# EAGLE schematic Sudden_XCVR_IF_Module_Schematic_like_board_layout (EAGLE 9.2.2)
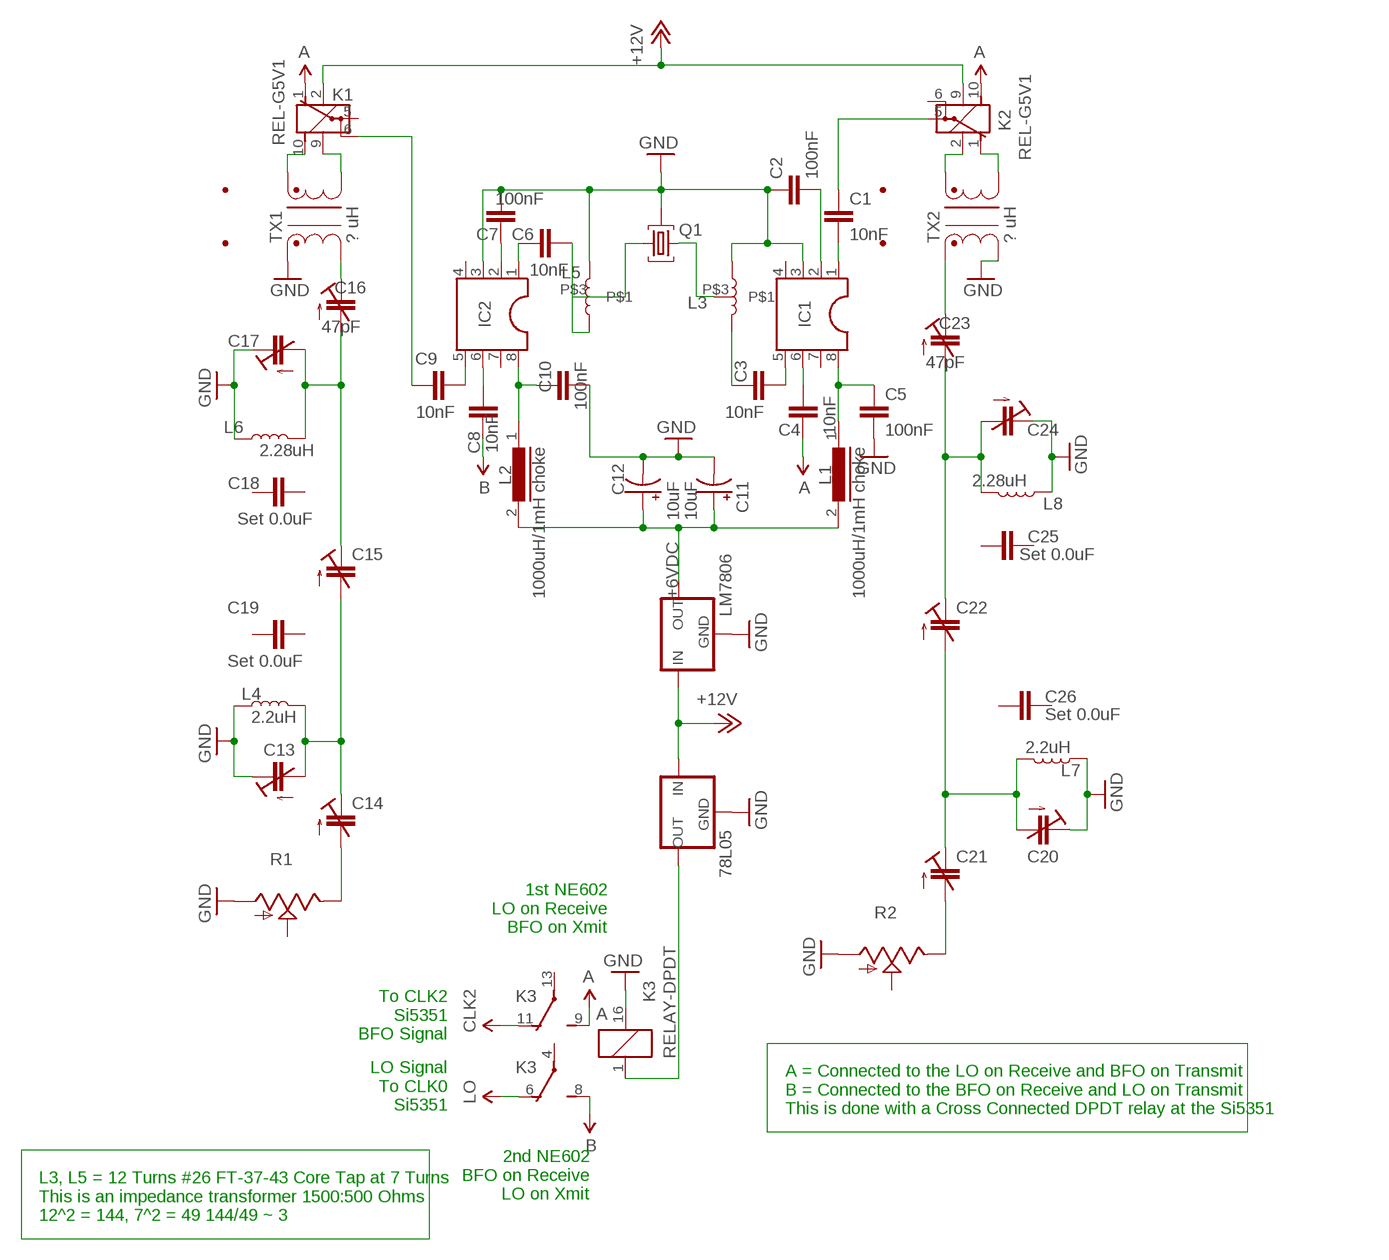
[diagram p0: schematic, sheet 1]

## Parts
78L05  78XXL  [78XXL]
A  A  VCC-IN  [POWER-IN-PAD]
A1  A  VCC-IN  [POWER-IN-PAD]
A2  A  VCC-IN  [POWER-IN-PAD]
B  B  VCC-IN  [POWER-IN-PAD]
C1  10nF  CAP-MEDIUM-MUPPET  [CAP-MEDIUM-MUPPET]
C2  100nF  CAP-MEDIUM-MUPPET  [CAP-MEDIUM-MUPPET]
C3  10nF  CAP-MEDIUM-MUPPET  [CAP-MEDIUM-MUPPET]
C4  10nF  CAP-MEDIUM-MUPPET  [CAP-MEDIUM-MUPPET]
C5  100nF  CAP-MEDIUM-MUPPET  [CAP-MEDIUM-MUPPET]
C6  10nF  CAP-MEDIUM-MUPPET  [CAP-MEDIUM-MUPPET]
C7  100nF  CAP-MEDIUM-MUPPET  [CAP-MEDIUM-MUPPET]
C8  10nF  CAP-MEDIUM-MUPPET  [CAP-MEDIUM-MUPPET]
C9  10nF  CAP-MEDIUM-MUPPET  [CAP-MEDIUM-MUPPET]
C10  100nF  CAP-MEDIUM-MUPPET  [CAP-MEDIUM-MUPPET]
C11  10uF  CAP-POLARIZED-RADIAL-2.5MM-25V-20%  [CAP-POLARIZED]
C12  10uF  CAP-POLARIZED-RADIAL-2.5MM-25V-20%  [CAP-POLARIZED]
C13  CAP-TRIMM3008  [CAP-TRIMM]
C14  CAP-TRIMM3008  [CAP-TRIMM]
C15  CAP-TRIMM3008  [CAP-TRIMM]
C16  47pF  CAP-TRIMM3008  [CAP-TRIMM]
C17  CAP-TRIMM3008  [CAP-TRIMM]
C18  Set 0.0uF  CAP-MEDIUM-MUPPET  [CAP-MEDIUM-MUPPET]
C19  Set 0.0uF  CAP-MEDIUM-MUPPET  [CAP-MEDIUM-MUPPET]
C20  CAP-TRIMM3008  [CAP-TRIMM]
C21  CAP-TRIMM3008  [CAP-TRIMM]
C22  CAP-TRIMM3008  [CAP-TRIMM]
C23  47pF  CAP-TRIMM3008  [CAP-TRIMM]
C24  CAP-TRIMM3008  [CAP-TRIMM]
C25  Set 0.0uF  CAP-MEDIUM-MUPPET  [CAP-MEDIUM-MUPPET]
C26  Set 0.0uF  CAP-MEDIUM-MUPPET  [CAP-MEDIUM-MUPPET]
CLK0  LO  VCC-IN  [POWER-IN-PAD]
CLK1  A  VCC-IN  [POWER-IN-PAD]
CLK2  CLK2  VCC-IN  [POWER-IN-PAD]
IC1  DUAL-INLINE-8DIL08-2  [DIL08]
IC2  DUAL-INLINE-8DIL08-2  [DIL08]
K1  REL-G5V1  RELAY-OMRON-G5V-1  [G5V1]
K2  REL-G5V1  RELAY-OMRON-G5V-1  [G5V1]
K3  RELAY-DPDT  RELAY-OMRON-G5V-2  [G5V-2]
L1  1000uH/1mH choke  MOLDED-CHOKES11  [MOLDED-CHOKE]
L2  1000uH/1mH choke  MOLDED-CHOKES11  [MOLDED-CHOKE]
L3  INDUCTOR-TAPPED  [INDUCTOR_TAPPED]
L4  2.2uH  INDUCTOR-VLF4012AT-2.2UH  [INDUCTOR_2.2UH]
L5  INDUCTOR-TAPPED  INDUCTOR-TAPPED-MIRROREDINDUCTOR_TAPPED_MIRRORED  [INDUCTOR_TAPPED_MIRRORED]
L6  2.28uH  INDUCTOR-VLF4012AT-2.2UH  [INDUCTOR_2.2UH]
L7  2.2uH  INDUCTOR-VLF4012AT-2.2UH  [INDUCTOR_2.2UH]
L8  2.28uH  INDUCTOR-VLF4012AT-2.2UH  [INDUCTOR_2.2UH]
LM7806  78XXL  [78XXL]
P+1  +12V  [POWER-IN-PAD]
P+2  +12V  [POWER-IN-PAD]
Q1  CRYSTAL-FILTER  [CRYSTAL-FILTER]
R1  POTENTIOMETER-TRIMCT6  [POT-TRIMM-4]
R2  POTENTIOMETER-TRIMCT6  [POT-TRIMM-4]
SUPPLY1  B  VCC-IN  [POWER-IN-PAD]
TX1  ? uH  TRANSFORMER_2WIRETRANSFORMER_2WIRE  [TRANSFORMER_TWO_WIRE]
TX2  ? uH  TRANSFORMER_2WIRETRANSFORMER_2WIRE  [TRANSFORMER_TWO_WIRE]

## Nets
3.3V: A1.VCC(3.3V) A2.VCC(3.3V) B.VCC(3.3V) C8.1 K1.1(2:O) K2.10(2:S) K3.8(1:S) SUPPLY1.VCC(3.3V)
+6VDC: C11.1(+) C12.1(+) L1.2 L2.2 LM7806.OUT
+12V: 78L05.IN K1.2 K2.9 LM7806.IN P+1.VCC(+12V) P+2.VCC(+12V)
A: A.VCC(3.3V) C4.1 CLK0.VCC(3.3V) CLK1.VCC(3.3V) K3.6(1:O) K3.9(2:S)
BFO: CLK2.VCC(3.3V) K3.11(2:O)
GND: 78L05.GND C2.1 C5.2 C7.1 C10.2 C11.2(-) C12.2(-) C13.+(E) C17.+(E) C20.+(E) C24.+(E) IC1.3 IC2.3 K3.16 L3.P$2 L4.P$1 L5.P$1 L6.P$1 L7.P$1 L8.P$1 LM7806.GND Q1.3 R1.A R2.A TX1.C1B TX2.C1A
N$1: C5.1 IC1.8 L1.1
N$2 [jim]: C4.2 IC1.6
N$3: C3.2 IC1.5
N$4: L5.P$3 Q1.1
N$5: C1.2 IC1.1
N$6: 78L05.OUT K3.1
N$7: C2.2 IC1.2
N$8: C16.+(E) TX1.C1A
N$9: C10.1 IC2.8 L2.1
N$11: C8.2 IC2.6
N$12: C9.2 IC2.5
N$13: C6.2 IC2.1
N$14: C6.1 L5.P$2
N$15: C7.2 IC2.2
N$16: L3.P$3 Q1.2
N$17: C3.1 L3.P$1
N$19: C1.1 K2.5(2:P)
N$20: C9.1 K1.6(2:P)
N$21: C15.+(E) C16.-(A) C17.-(A) L6.P$2
N$22: C14.-(A) R1.E
N$23: C13.-(A) C14.+(E) C15.-(A) L4.P$2
N$24: C23.+(E) TX2.C1B
N$25: C22.+(E) C23.-(A) C24.-(A) L8.P$2
N$26: C20.-(A) C21.+(E) C22.-(A) L7.P$2
N$27: C21.-(A) R2.E
N$28: K1.9 TX1.C2A
N$29: K1.10(2:S) TX1.C2B
N$30: K2.2 TX2.C2B
N$31: K2.1(2:O) TX2.C2A
Unconnected: C18.1 C18.2 C19.1 C19.2 C25.1 C25.2 C26.1 C26.2 IC1.4 IC1.7 IC2.4 IC2.7 K1.5(2:P) K2.6(2:P) K3.4(1:P) K3.13(2:P) R1.S R2.S

## Notes on the sheet
- 1st NE602
  LO on Receive
  BFO on Xmit
- To CLK2
  Si5351
  BFO Signal
- LO Signal
  To CLK0
  Si5351
- A = Connected to the LO on Receive and BFO on Transmit
  B = Connected to the BFO on Receive and LO on Transmit
  This is done with a Cross Connected DPDT relay at the Si5351
- 2nd NE602
  BFO on Receive
  LO on Xmit
- L3, L5 = 12 Turns #26 FT-37-43 Core Tap at 7 Turns
  This is an impedance transformer 1500:500 Ohms
  12^2 = 144, 7^2 = 49 144/49 ~ 3

## Library data of the parts
78L05 LM7806 = jim_muppet_parts:78XXL: VOLTAGE REGULATOR
A A1 A2 B CLK0 CLK1 CLK2 SUPPLY1 = jim_muppet_parts:VCC-IN: SUPPLY SYMBOL
C1-C10 = jim_muppet_parts:CAP-MEDIUM-MUPPET: Capacitor - Muppet style - Medium size SMT Pads 120 square SMT pads; PROD_ID: JIM-CAP Large SMT; VALUE: Set 0.0uF
C11 C12 = jim_muppet_parts:CAP-POLARIZED: 100µF polarized capacitors A capacitor is a passive two-terminal electrical component used to store electrical energy temporarily in an electric field.; PROD_ID: CAP-08439; VALUE: 100uF
C13-C17 C20-C24 = jim_muppet_parts:CAP-TRIMM: Trimm capacitor; OC_FARNELL: unknown; OC_NEWARK: unknown
C18 C19 C25 C26 = jim_muppet_parts:CAP-MEDIUM-MUPPET: Capacitor - Muppet style - Medium size SMT Pads 120 square SMT pads; PROD_ID: JIM-CAP Large SMT
IC1 IC2 = jim_muppet_parts:DUAL-INLINE-8: Dual In Line / Socket
K1 K2 = jim_muppet_parts:RELAY-OMRON-G5V-1: RELAY 1 x switch, 0.5 A/125 V AC, 1A/12V DC , Omron; MPN: G5V-1-DC24; OC_FARNELL: 9949593; OC_NEWARK: 36M6377
K3 = jim_muppet_parts:RELAY-OMRON-G5V-2: OMRON PCB DPDT Relay 12VDC, 2A, G5V-2 Series Source: http://www.omron.com/ecb/products/pdf/en-g5v2.pdf; MPN: G5V-2 5DC; OC_FARNELL: 9949488; OC_NEWARK: 78K5703
L1 L2 = jim_muppet_parts:MOLDED-CHOKE: Molded Choke; OC_FARNELL: unknown; OC_NEWARK: unknown
L3 = jim_muppet_parts:INDUCTOR-TAPPED: Tapped Inductor Tapped coil which resist changes in electrical current
L4 L6-L8 = jim_muppet_parts:INDUCTOR: Inductors Resist changes in electrical current. Basically a coil of wire. SparkFun Products: SparkFun Load Cell Amplifier - HX711 <https://www.sparkfun.com/products/13879> IOIO-OTG - V2.2 <https://www.sparkfun.com/products/13613>; PROD_ID: NDUC-09513; VALUE: 2.2µH/±20%/1.5A
L5 = jim_muppet_parts:INDUCTOR-TAPPED-MIRRORED: Tapped Inductor Tapped coil which resist changes in electrical current
P+1 P+2 = jim_muppet_parts:+12V: SUPPLY SYMBOL
Q1 = jim_muppet_parts:CRYSTAL-FILTER: CRYSTAL; OC_FARNELL: unknown; OC_NEWARK: unknown
R1 R2 = jim_muppet_parts:POTENTIOMETER-TRIM: POTENTIOMETER
TX1 TX2 = jim_muppet_parts:TRANSFORMER_2WIRE: Transformer with 2 independent windings

## Net classes
0 default: width 0.813 mm, clearance 1.016 mm
1 jim: width 0.889 mm, clearance 0.889 mm